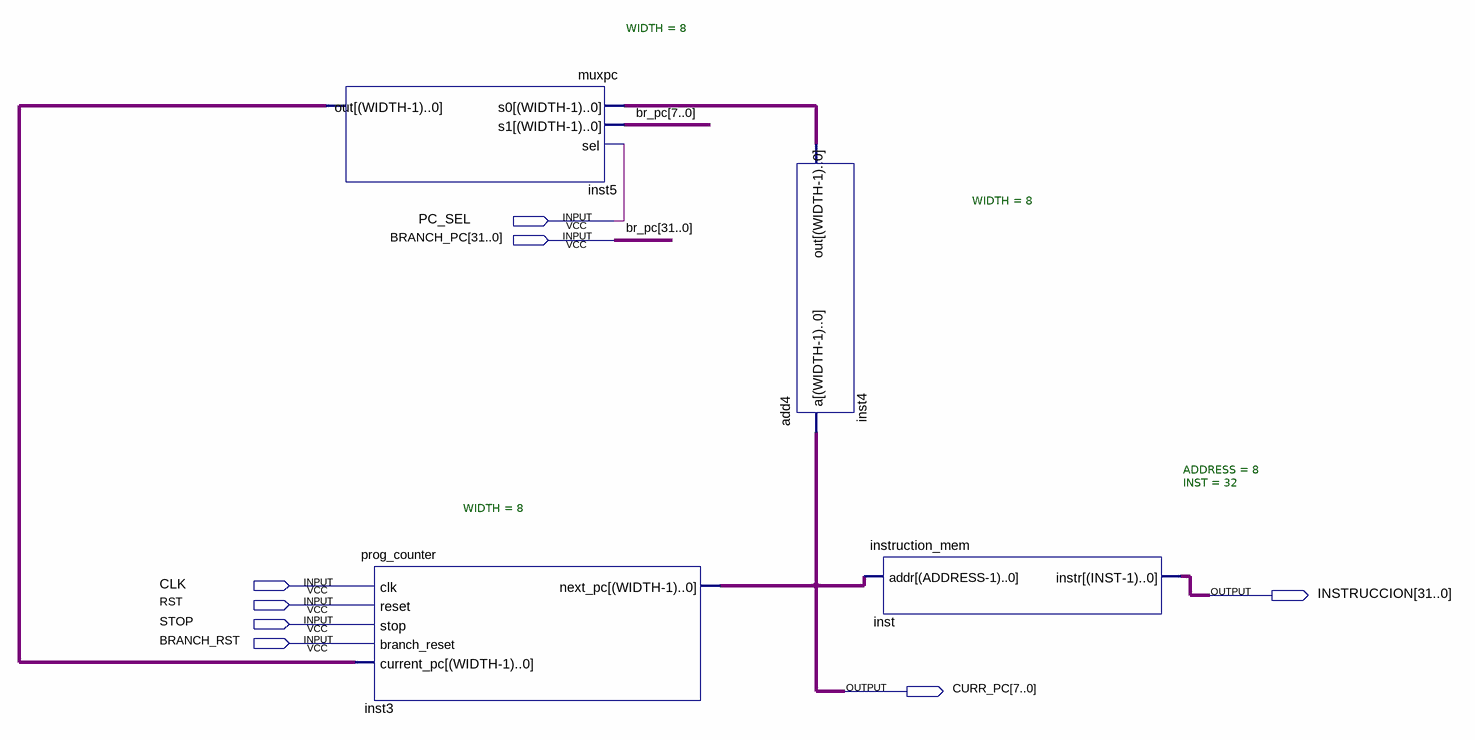
[diagram p0: schematic sheet]
// Quartus schematic fetch_unit.bdf as structural Verilog: 4 symbols, 8 pins
module fetch_unit (
  input  PC_SEL,
  input  [31:0] BRANCH_PC,
  input  CLK,
  input  RST,
  input  STOP,
  input  BRANCH_RST,
  output [31:0] INSTRUCCION,
  output [7:0] CURR_PC
);

  wire [7:0] inst4_out, inst5_out;

  muxpc #(.WIDTH(8)) inst5 (.s0(inst4_out), .s1(BRANCH_PC[7:0]), .sel(PC_SEL), .out(inst5_out));
  prog_counter #(.WIDTH(8)) inst3 (
    .clk(CLK), .reset(RST), .stop(STOP), .branch_reset(BRANCH_RST), .current_pc(inst5_out), .next_pc(CURR_PC));
  add4 #(.WIDTH(8)) inst4 (.a(CURR_PC), .out(inst4_out));
  instruction_mem #(.ADDRESS(8), .INST(32)) inst (.addr(CURR_PC), .instr(INSTRUCCION));

  // Other names for the same wires on the sheet: br_pc[31:0] = BRANCH_PC
endmodule
